# EAGLE design DVI (EAGLE 9.6.2)
COMPANY: ADAFRUIT INDUSTRIES; DRAWN: KTOWN; REV: C
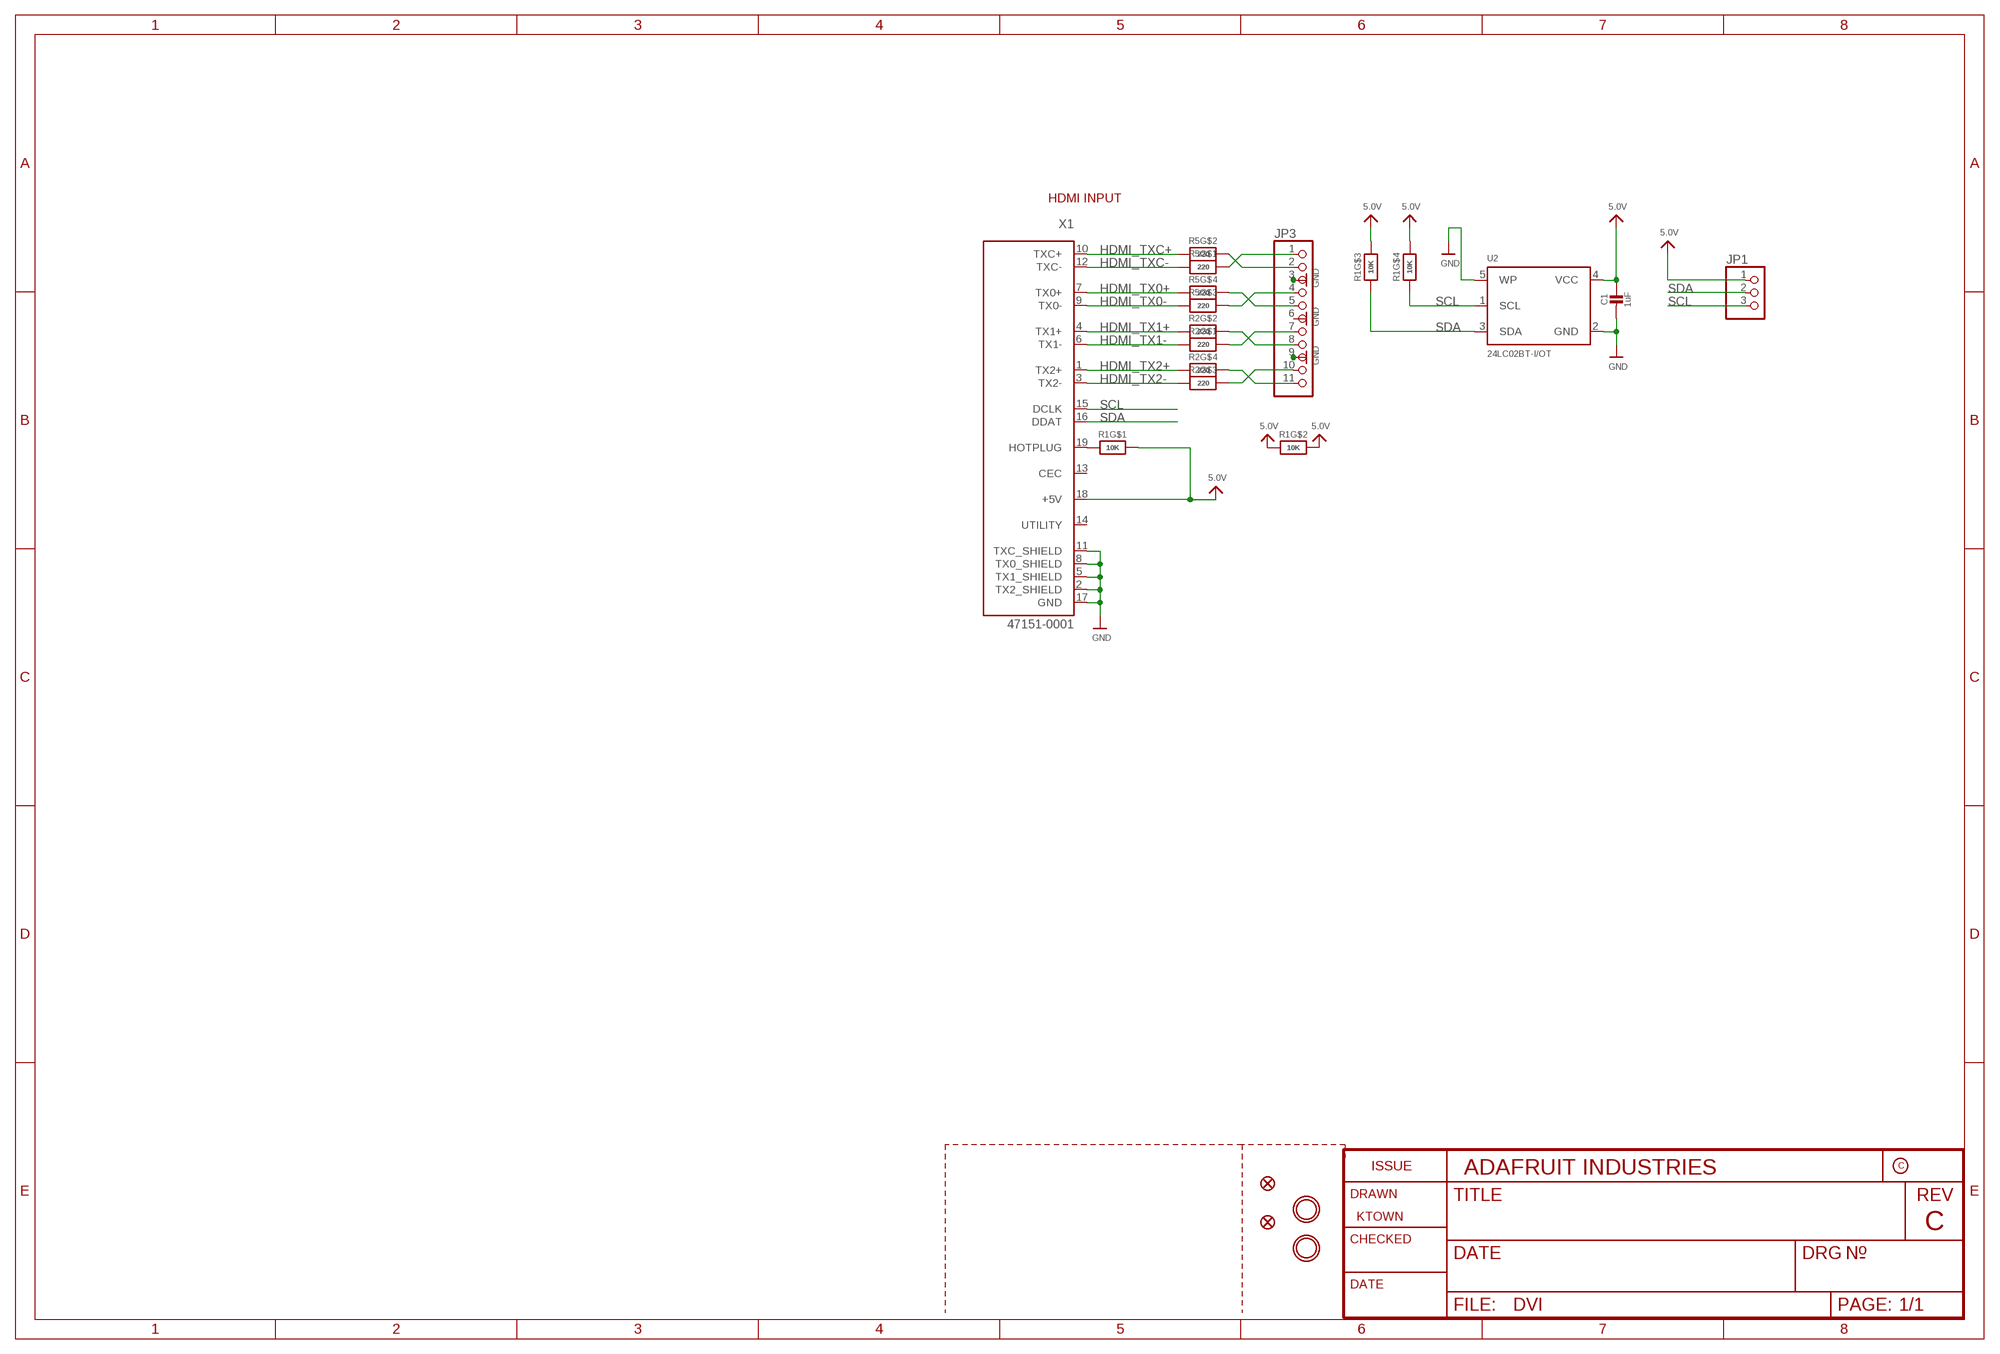
[diagram p0: schematic, sheet 1]

## Parts
C1  1uF  CAP_CERAMIC0603_NO  [0603-NO]
FID1  FIDUCIAL_1MM  [FIDUCIAL_1MM]
FID2  FIDUCIAL_1MM  [FIDUCIAL_1MM]
JP1  HEADER-1X3ROUND  [1X03_ROUND]
JP3  HEADER-1X11  [1X11_ROUND]
R1  10K  RESISTOR_4PACK  [RESPACK_4X0603]
R2  220  RESISTOR_4PACK  [RESPACK_4X0603]
R5  220  RESISTOR_4PACK  [RESPACK_4X0603]
U2  24LC02BT-I/OT  EEPROM_I2C_MCP24AA32  [SOT23-5]
U$32  MOUNTINGHOLE2.5  [MOUNTINGHOLE_2.5_PLATED]
U$33  MOUNTINGHOLE2.5  [MOUNTINGHOLE_2.5_PLATED]
X1  47151-0001  HDMI_MOLEX_47151  [HDMI_MOLEX_47151-0001]

## Nets
5.0V: C1.1 JP1.1 R1.2 R1.5 R1.6 R1.7 R1.8 U2.4(VCC) X1.18(+5V)
GND: C1.2 JP3.3 JP3.6 JP3.9 U2.2(GND) U2.5(WP) X1.2(TX2_SHIELD) X1.5(TX1_SHIELD) X1.8(TX0_SHIELD) X1.11(TXC_SHIELD) X1.17(GND)
HDMI_TX0+: R5.4 X1.7(TX0+)
HDMI_TX0-: R5.3 X1.9(TX0-)
HDMI_TX1+: R2.2 X1.4(TX1+)
HDMI_TX1-: R2.1 X1.6(TX1-)
HDMI_TX2+: R2.4 X1.1(TX2+)
HDMI_TX2-: R2.3 X1.3(TX2-)
HDMI_TXC+: R5.2 X1.10(TXC+)
HDMI_TXC-: R5.1 X1.12(TXC-)
N$7: R1.1 X1.19(HOTPLUG)
SCL: JP1.3 R1.4 U2.1(SCL) X1.15(DCLK)
SDA: JP1.2 R1.3 U2.3(SDA) X1.16(DDAT)
TX0+: JP3.5 R5.5
TX0-: JP3.4 R5.6
TX1+: JP3.8 R2.7
TX1-: JP3.7 R2.8
TX2+: JP3.11 R2.5
TX2-: JP3.10 R2.6
TXC+: JP3.2 R5.7
TXC-: JP3.1 R5.8
Unconnected: X1.13(CEC) X1.14(UTILITY)

## Notes on the sheet
- HDMI INPUT

## Power pins joined to a net without a drawn wire
GND: X1.P$1(GND) X1.P$2(GND) X1.P$3(GND) X1.P$4(GND)

## Library data of the parts
C1 = microbuilder:CAP_CERAMIC: Ceramic Capacitors For new designs, use the packages preceded by an '_' character since they are more reliable: The following footprints should be used on most boards: _0402 - Standard footprint for regular board layouts _0603 - Standard footprint for regular board layouts _0805 - Standard footprint for regular board layouts _1206 - Standard footprint for regular board layouts For extremely tight-pitch boards where space is at a premium, the following 'micro-pitch' footprints can be used (smaller pads, no silkscreen outline, etc.): _0402MP - Micro-pitch footprint for very dense/compact boards _0603MP - Micro-pitch footprint for very dense/compact boards _0805MP - Micro-pitch footprint for very dense/compact boards _1206MP - Micro-pitch footprint for very dense/compact boards
FID1 FID2 = microbuilder:FIDUCIAL: Fiducial Alignment Points Various fiducial points for machine vision alignment.; BOM: EXCLUDE
JP1 = microbuilder:HEADER-1X3: PIN HEADER
JP3 = microbuilder:HEADER-1X11
R1 R2 R5 = microbuilder:RESISTOR_4PACK: Resistor Packs (4 resistors) 4 x 0603 10K 1/16W - Digikey: YC164J-10KCT-ND
U2 = microbuilder:EEPROM_I2C_MCP24AA32: Microchip 32K (4K x 8) 1.8V I2C EEPROM SOT23-5 [Digikey: 24AA32AFT-I/OTCT-ND]
U$32 U$33 = microbuilder:MOUNTINGHOLE: Mounting Hole For #2 screws (0.086"/2.18mm width, 0.094"/2.4mm hole) use 2.5mm; BOM: EXCLUDE
X1 = adafruit_electromech:HDMI_MOLEX_47151: The default footprint uses layer 46 (Milling) for the tabs, the DIMLAYER footprint uses layer 20 (Dimensions). Both will probably require special instructions to the board house

## Board
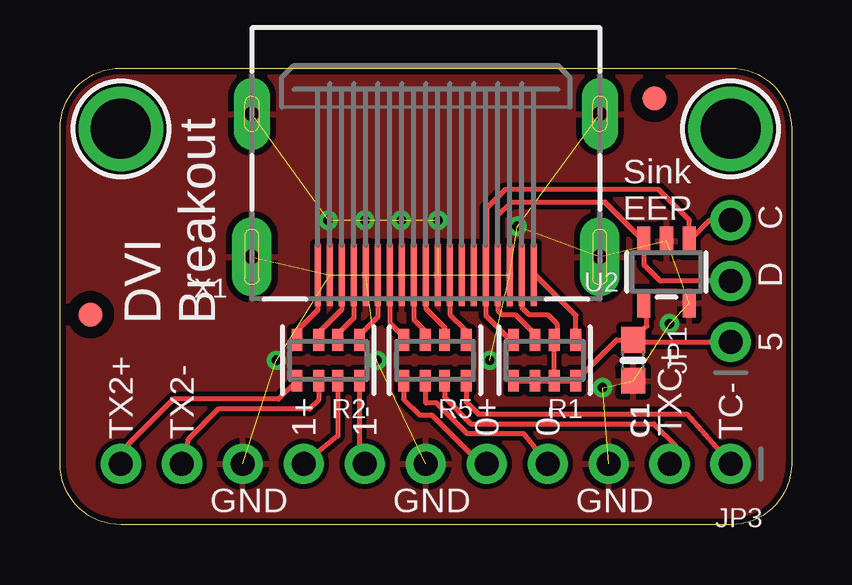
[diagram p1: board, top side]
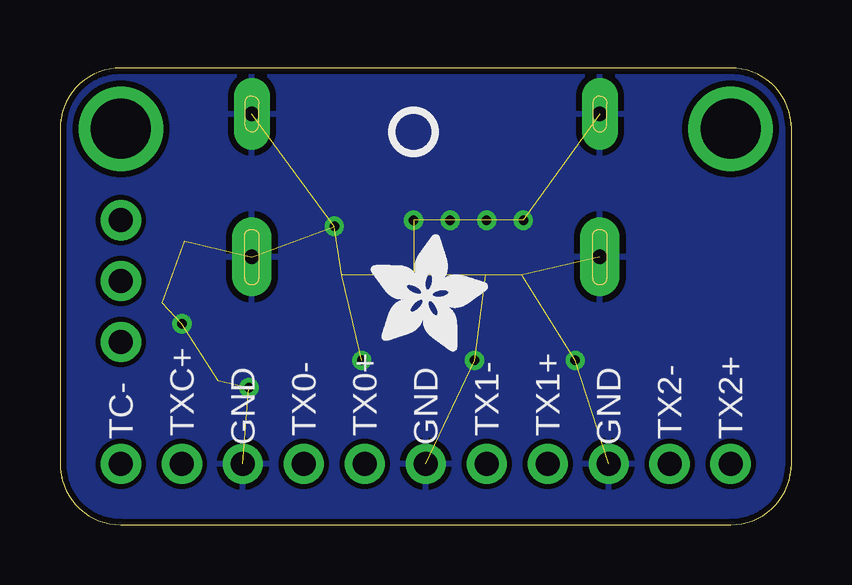
[diagram p2: board, bottom side, seen from below]

Size 30.48 x 19.05 mm. Coordinates in mm from the lower left corner, seen from the top.
Outline: 0,2.54 0,16.51 arc-90 2.54,19.05 27.94,19.05 arc-90 30.48,16.51 30.48,2.54 arc-90 27.94,0 2.54,0 arc-90 0,2.54
Copper layers (1*16): Top 0.035mm / dielectric 1.5mm / Bottom 0.035mm
Design rules "adafruit": minimum track width 8mil, minimum drill 15.5mil, track to track 8mil, track to pad 8mil, pad to pad 8mil, via to via 8mil, smd to smd 8mil, copper to edge 10mil, drill to drill 8mil, minimum pad ring 10mil, minimum via ring 8mil, stop-mask expansion 2mil, vias tented up to drill 20mil, thermal gap 10mil

### Footprints (pad centres in the part's own frame; a part is rotated, then mirrored left to right if it is on the bottom)
0603-NO = smd 1.075 x 1: 1 -0.85,0; 2 0.85,0
FIDUCIAL_1MM = smd 1 x 1: 1 0,0
1X03_ROUND = drill 1 pad 1.676: 1 -2.54,0; 2 0,0; 3 2.54,0
1X11_ROUND = drill 1 pad 1.676: 1 -12.7,0; 2 -10.16,0; 3 -7.62,0; 4 -5.08,0; 5 -2.54,0; 6 0,0; 7 2.54,0; 8 5.08,0; 9 7.62,0; 10 10.16,0; 11 12.7,0
RESPACK_4X0603 = smd 0.45 x 0.9: 1 -1.3,-0.85; 2 -0.4,-0.85; 3 0.4,-0.85; 4 1.3,-0.85; 5 1.3,0.85; 6 0.4,0.85; 7 -0.4,0.85; 8 -1.3,0.85
SOT23-5 = smd 0.55 x 1.2: 1 -0.95,-1.3; 2 0,-1.3; 3 0.95,-1.3; 4 0.95,1.3; 5 -0.95,1.3
MOUNTINGHOLE_2.5_PLATED = drill 2.5 pad 3.2: P$1 0,0
HDMI_MOLEX_47151-0001 = smd 0.25 x 2.6: 1 4.5,0; 2 4,0; 3 3.5,0; 4 3,0; 5 2.5,0; 6 2,0; 7 1.5,0; 8 1,0; 9 0.5,0; 10 0,0; 11 -0.5,0; 12 -1,0; 13 -1.5,0; 14 -2,0; 15 -2.5,0; 16 -3,0; 17 -3.5,0; 18 -4,0; 19 -4.5,0 | drill 0.6 pad 1.65 long: P$1 -7.25,-0.76; P$2 7.25,-0.76 | drill 0.6 pad 1.5 long: P$3 7.25,-6.72; P$4 -7.25,-6.72

### Placement (x,y rotation side)
C1  23.88,6.86 270 top
FID1  24.77,17.78 270 top
FID2  1.27,8.76 270 top
JP1  27.94,10.16 90 top
JP3  15.24,2.54 180 top
R1  20.19,6.86 180 top
R2  11.18,6.86 180 top
R5  15.62,6.86 180 top
U2  25.27,10.54 180 top
U$6  [ADAFRUIT_5MM]  17.53,7.24 0 bottom
U$32  2.54,16.51 180 top
U$33  27.94,16.51 180 top
U$73  [PCBFEAT-REV-040]  15.75,16.38 0 bottom
X1  15.24,10.41 180 top

### Tracks (layer width: path | path; a pad name or v marks a point on that pad's centre or on a via)
5.0V
  Top 0.203: R1.5 R1.6 R1.7 | X1.18 19.24,9.06 19.54,8.76 20.32,8.76 20.72,8.37 20.72,7.71 R1.2 R1.7 | R1.7 R1.8 | 24.32,8.84 24.45,8.96 24.45,8.28 C1.1 | 21.62,6.01 R1.8 | 24.32,8.71 24.32,8.84 | 24.32,8.84 U2.4 | C1.1 23.96,7.62 JP1.1 | R1.8 23.19,7.71 C1.1
GND  (via drill 0.39)  (24 unrouted)
  other vias: 11.18,12.7 12.7,12.7 14.22,12.7 15.75,12.7 19.05,12.45 13.21,6.86 17.91,6.86 9.02,6.86 22.61,5.71 25.4,8.38
  pour Top: 0,19.05 30.48,19.05 30.48,0 0,0
  pour Bottom: 0,19.05 30.48,19.05 30.48,0 0,0
HDMI_TX0+
  Top 0.203: X1.7 13.74,8.42 14.32,7.83 R5.4
HDMI_TX0-
  Top 0.203: X1.9 14.74,8.57 15.22,8.09 R5.3
HDMI_TX1+
  Top 0.203: X1.4 12.24,8.62 11.58,7.95 R2.2
HDMI_TX1-
  Top 0.203: X1.6 13.24,8.67 12.48,7.9 R2.1
HDMI_TX2+
  Top 0.203: X1.1 10.74,8.96 9.88,8.1 R2.4
HDMI_TX2-
  Top 0.203: X1.3 11.74,8.98 10.78,8.01 R2.3
HDMI_TXC+
  Top 0.203: X1.10 15.24,9.02 16.02,8.24 R5.2
HDMI_TXC-
  Top 0.203: X1.12 16.24,8.78 16.92,8.1 R5.1
N$7
  Top 0.203: X1.19 19.81,10.41 21.49,8.73 R1.1
SCL
  Top 0.203: R1.4 18.77,7.71 17.74,8.73 X1.15 17.78,10.45 17.78,13.21 18.54,13.97 24.95,13.97 26.22,12.7 U2.1 27.08,12.7 JP1.3
SDA
  Top 0.203: JP1.2 25.02,10.16 24.32,10.86 U2.3 22.7,13.46 18.8,13.46 18.24,12.91 X1.16 18.24,8.94 18.41,8.76 18.96,8.76 19.79,7.93 R1.3
TX0+
  Top 0.203: JP3.5 17.53,2.54 15.49,4.57 14.99,4.57 14.32,5.24 R5.5
TX0-
  Top 0.203: R5.6 15.22,5.12 15.26,5.08 15.68,5.08 16.95,3.81 19.3,3.81 JP3.4
TX1+
  Top 0.203: JP3.8 11.58,3.7 R2.7
TX1-
  Top 0.203: JP3.7 12.48,3.02 R2.8
TX2+
  Top 0.203: R2.5 9.11,5.25 4.74,5.25 2.79,3.3 JP3.11
TX2-
  Top 0.203: R2.6 10.78,5.19 10.41,4.83 6.6,4.83 5.33,3.56 JP3.10
TXC+
  Top 0.203: R5.7 16.02,5.32 17.12,4.22 24.74,4.22 25.65,3.3 JP3.2
TXC-
  Top 0.203: R5.8 16.92,5.12 17.42,4.62 26.11,4.62 JP3.1

### Text on the board
tPlace: Sink / EEP | C | D | DVI / Breakout | 5 | TX2+ | TX2- | 1+ | 1- | 0+ | 0- | TXC+ | TC- | GND | GND | GND
bPlace: GND | GND | GND | TX2+ | TX2- | TX1+ | TX1- | TX0+ | TX0- | TXC+ | TC-